# EAGLE design GauntletV2 (EAGLE 9.5.2)
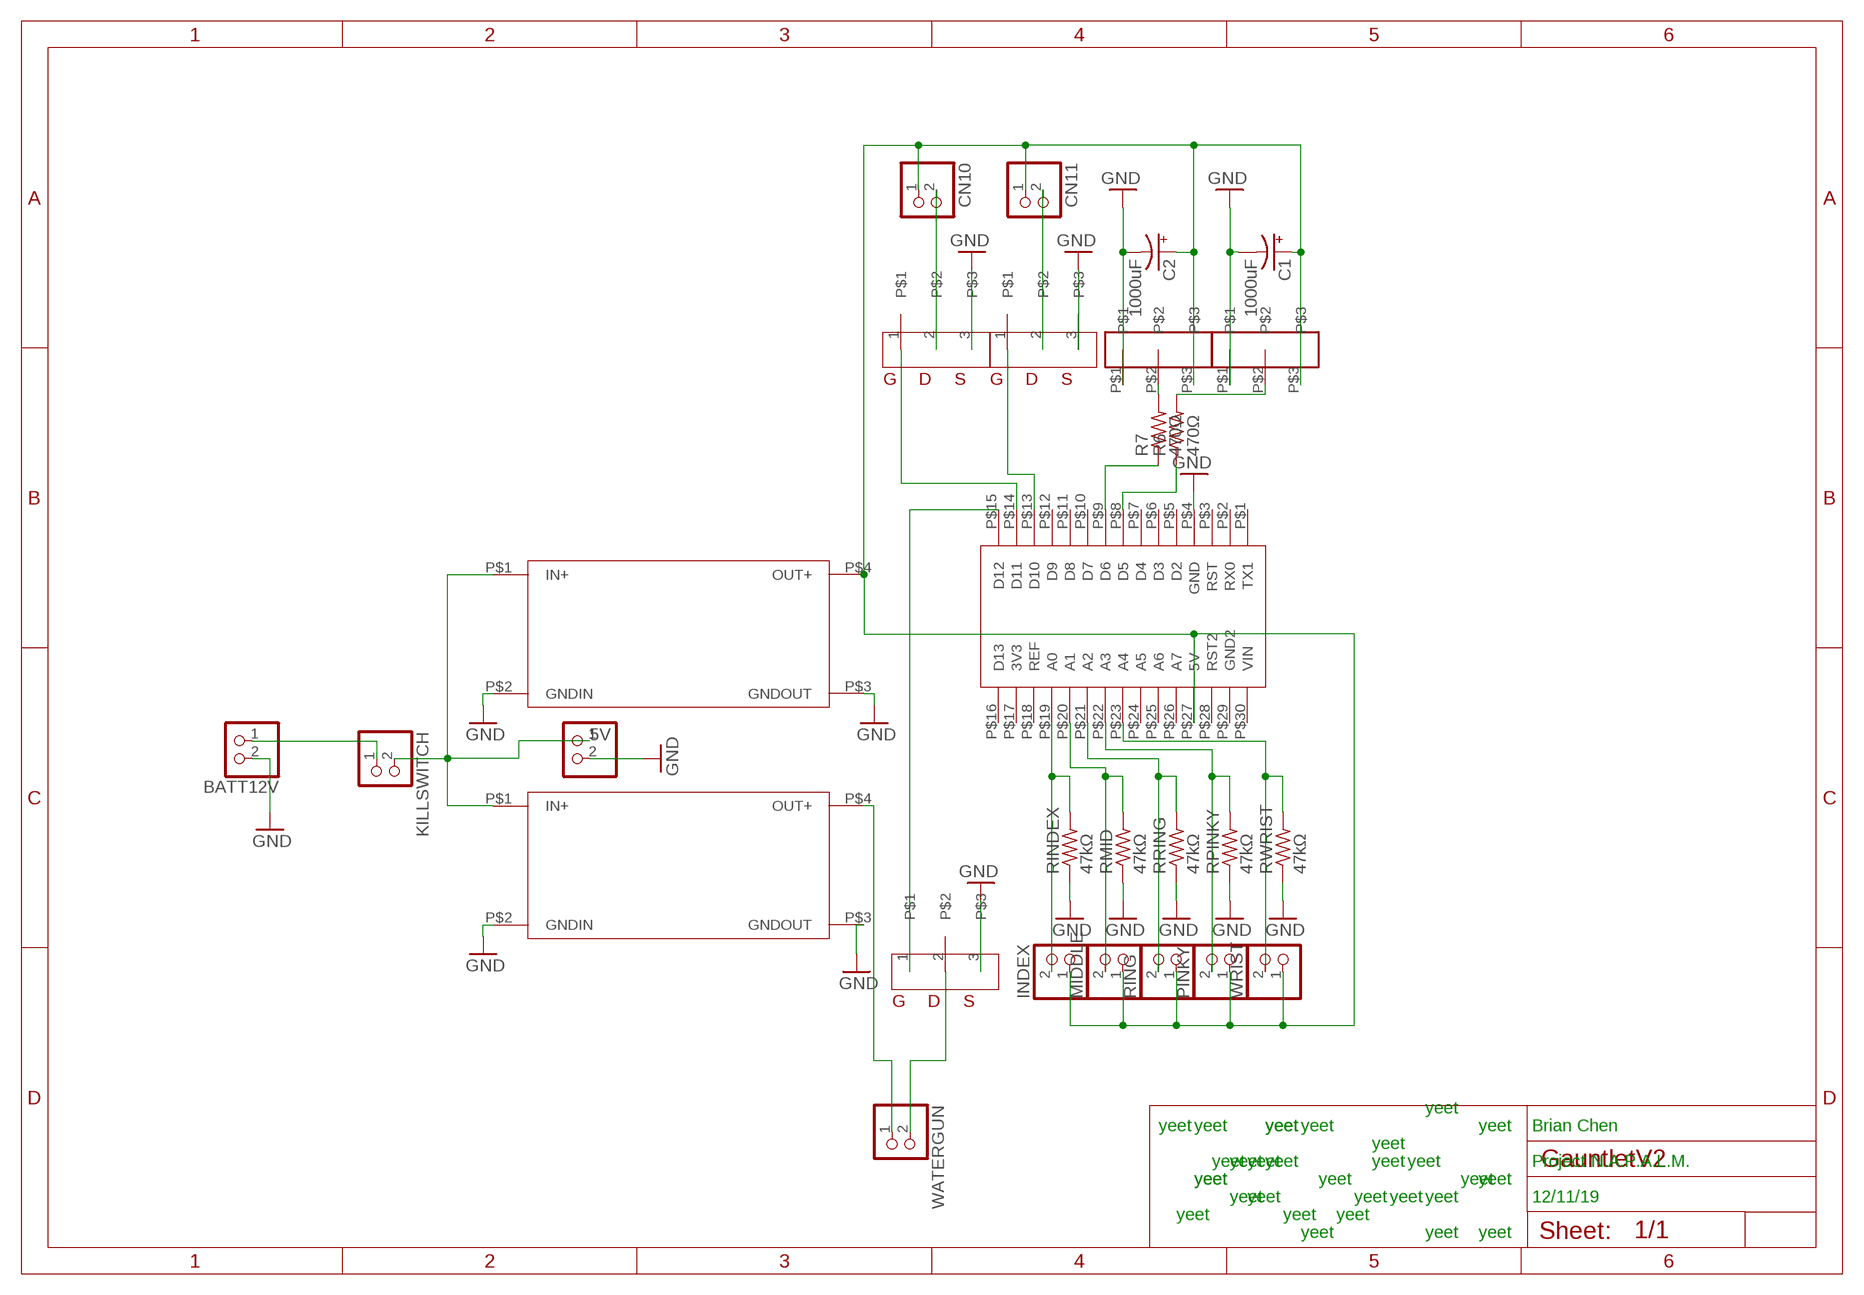
[diagram p0: schematic, sheet 1]

## Parts
5VBUCK  LM2596BUCK  [LM2596BUCK]
6VBUCK  LM2596BUCK  [LM2596BUCK]
BATT12V  JST_2PIN-THM-RA  [JST-PH-2-THM-RA]
C1  1000uF  CPOL-USE5-10.5  [E5-10,5]
C2  1000uF  CPOL-USE5-10.5  [E5-10,5]
CN10  JST_2PIN-THM-RA  [JST-PH-2-THM-RA]
CN11  JST_2PIN-THM-RA  [JST-PH-2-THM-RA]
GUNMOSFET  TO254P1052X465X1989-3  [TO254P1052X465X1989-3]
INDEX  JST_2PIN-THM-RA  [JST-PH-2-THM-RA]
KILLSWITCH  JST_2PIN-THM-RA  [JST-PH-2-THM-RA]
MIDDLE  JST_2PIN-THM-RA  [JST-PH-2-THM-RA]
NANO  NANOV3  [NANOV3]
PINKY  JST_2PIN-THM-RA  [JST-PH-2-THM-RA]
R6  470Ω  R-US_0207/9  [0207/9]
R7  470Ω  R-US_0207/9  [0207/9]
RINDEX  47kΩ  R-US_0207/9  [0207/9]
RING  JST_2PIN-THM-RA  [JST-PH-2-THM-RA]
RMID  47kΩ  R-US_0207/9  [0207/9]
RPINKY  47kΩ  R-US_0207/9  [0207/9]
RRING  47kΩ  R-US_0207/9  [0207/9]
RWRIST  47kΩ  R-US_0207/9  [0207/9]
U$4  TO254P1052X465X1989-3  [TO254P1052X465X1989-3]
U$5  TO254P1052X465X1989-3  [TO254P1052X465X1989-3]
U$7  3WIRECONNECTOR  [3WIRECONNECTOR]
U$8  3WIRECONNECTOR  [3WIRECONNECTOR]
VOLTMETER  JST_2PIN-THM-RA  [JST-PH-2-THM-RA]
WATERGUN  JST_2PIN-THM-RA  [JST-PH-2-THM-RA]
WRIST  JST_2PIN-THM-RA  [JST-PH-2-THM-RA]

## Nets
5V: 5VBUCK.P$1(IN+) 6VBUCK.P$1(IN+) KILLSWITCH.2 VOLTMETER.1
GND: 5VBUCK.P$2(GNDIN) 5VBUCK.P$3(GNDOUT) 6VBUCK.P$2(GNDIN) 6VBUCK.P$3(GNDOUT) BATT12V.2 C1.- C2.- GUNMOSFET.3 NANO.P$4(GND) RINDEX.1 RMID.1 RPINKY.1 RRING.1 RWRIST.1 U$4.3 U$5.3 U$7.P$1 U$8.P$1 VOLTMETER.2
N$1: BATT12V.1 KILLSWITCH.1
N$2: 5VBUCK.P$4(OUT+) C1.+ C2.+ CN10.1 CN11.1 INDEX.1 MIDDLE.1 NANO.P$27(5V) PINKY.1 RING.1 U$7.P$3 U$8.P$3 WRIST.1
N$3: R7.2 U$7.P$2
N$4: GUNMOSFET.2 WATERGUN.2
N$5: 6VBUCK.P$4(OUT+) WATERGUN.1
N$6: GUNMOSFET.1 NANO.P$15(D12)
N$7: INDEX.2 NANO.P$19(A0) RINDEX.2
N$8: NANO.P$23(A4) RWRIST.2 WRIST.2
N$9: NANO.P$21(A2) RING.2 RRING.2
N$10: MIDDLE.2 NANO.P$20(A1) RMID.2
N$11: NANO.P$22(A3) PINKY.2 RPINKY.2
N$12: NANO.P$14(D11) U$5.1
N$13: NANO.P$13(D10) U$4.1
N$14: CN10.2 U$5.2
N$15: CN11.2 U$4.2
N$16: NANO.P$9(D6) R7.1
N$17: R6.2 U$8.P$2
N$18: NANO.P$8(D5) R6.1
Unconnected: NANO.P$1(TX1) NANO.P$2(RX0) NANO.P$3(RST) NANO.P$5(D2) NANO.P$6(D3) NANO.P$7(D4) NANO.P$10(D7) NANO.P$11(D8) NANO.P$12(D9) NANO.P$16(D13) NANO.P$17(3V3) NANO.P$18(REF) NANO.P$24(A5) NANO.P$25(A6) NANO.P$26(A7) NANO.P$28(RST2) NANO.P$29(GND2) NANO.P$30(VIN)

## Notes on the sheet
- yeet
- yeet | yeet | yeet | yeet | yeet | yeet | Brian Chen
- yeet
- yeet | yeet | yeet | yeet | yeet | yeet | Project N.A.P.A.L.M.
- yeet | yeet | yeet | yeet | yeet
- yeet | yeet | yeet | yeet | yeet | 12/11/19
- yeet | yeet | yeet
- yeet | yeet | yeet

## Library data of the parts
5VBUCK 6VBUCK = GauntletV2:LM2596BUCK
BATT12V CN10 CN11 INDEX KILLSWITCH MIDDLE PINKY RING VOLTMETER WATERGUN WRIST = adafruit:JST_2PIN: JST 2-Pin Connectors of various flavors SMT-RA (S2B-PH-SM4) 4UConnector #17311 SMT (B2B-PH-SM4) THM-RA (S2B-PH) THM (B2B-PH)
C1 C2 = adafruit:CPOL-US: POLARIZED CAPACITOR, American symbol
GUNMOSFET U$4 U$5 = TO254P1052X465X1989-3:TO254P1052X465X1989-3
NANO = GauntletV2:NANOV3
R6 R7 RINDEX RMID RPINKY RRING RWRIST = adafruit:R-US_: RESISTOR, American symbol
U$7 U$8 = GauntletV2:3WIRECONNECTOR

## Board
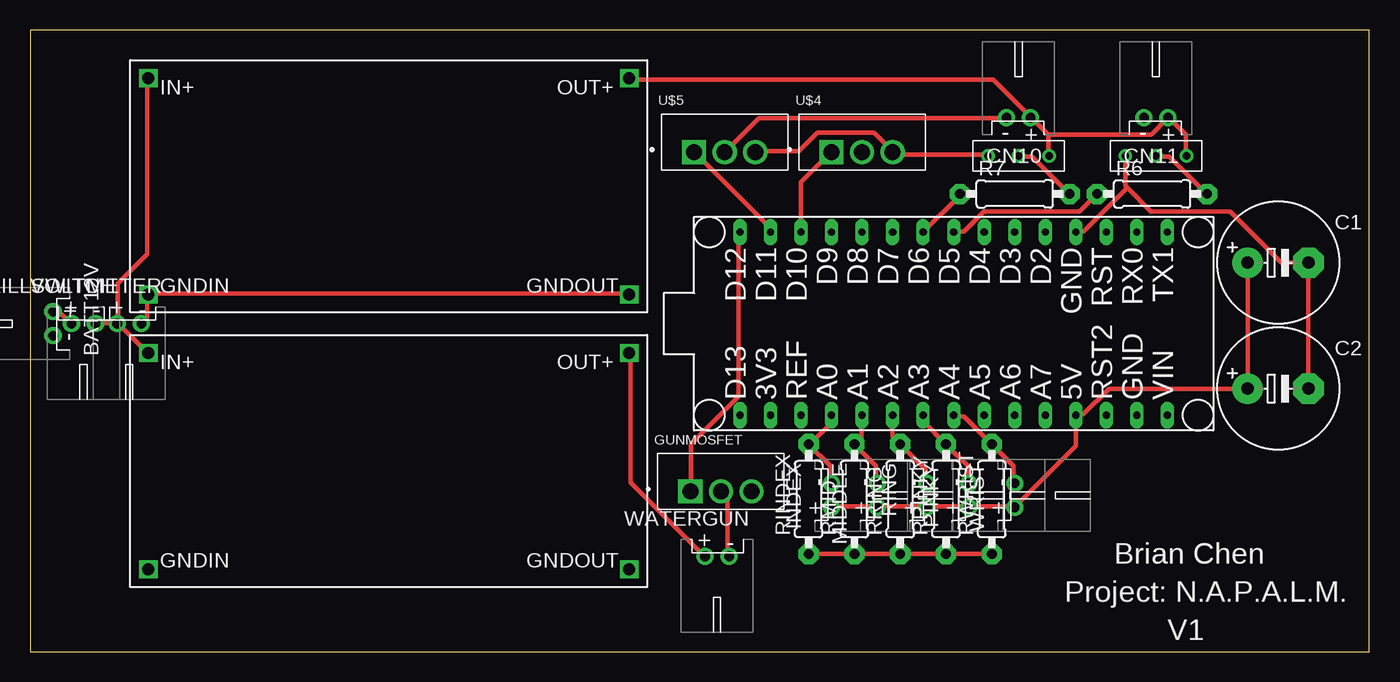
[diagram p1: board, top side]
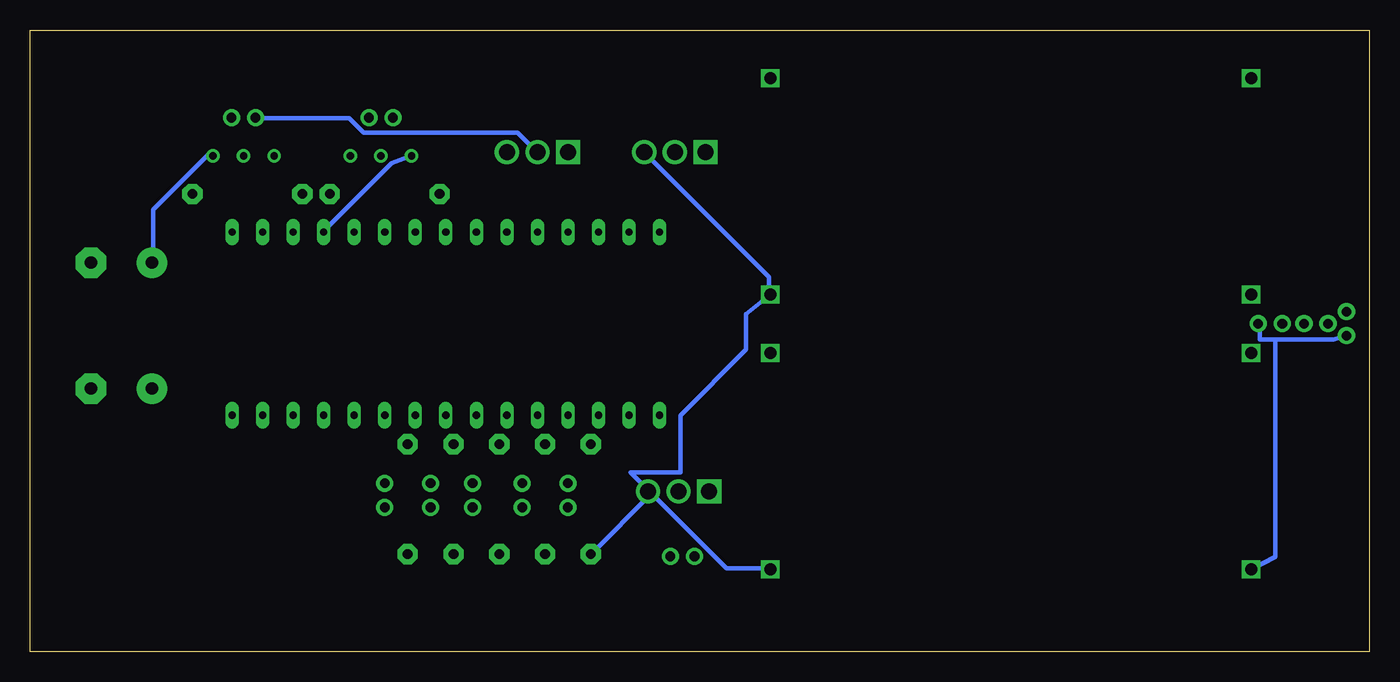
[diagram p2: board, bottom side, seen from below]

Size 111.42 x 51.74 mm. Coordinates in mm from the lower left corner, seen from the top.
Outline: 0,0 111.42,0 111.42,51.74 0,51.74 0,0
Copper layers (1*16): Top 0.035mm / dielectric 1.5mm / Bottom 0.035mm
Design rules "default": minimum track width 6mil, minimum drill 0.35mm, track to track 6mil, track to pad 6mil, pad to pad 6mil, via to via 6mil, smd to smd 6mil, copper to edge 40mil, drill to drill 6mil, minimum pad ring 10mil, minimum via ring 8mil, stop-mask expansion 4mil, vias tented up to drill 0mil, thermal gap 10mil

### Footprints (pad centres in the part's own frame; a part is rotated, then mirrored left to right if it is on the bottom)
LM2596BUCK = drill 1 square: P$1 -20,9; P$2 -20,-9; P$3 20,-9; P$4 20,9
JST-PH-2-THM-RA = drill 0.8 pad 1.422: 1 1,0; 2 -1,0
E5-10,5 = drill 1.016 pad 2.54: + -2.54,0 | drill 1.016 pad 2.54 octagon: - 2.54,0
TO254P1052X465X1989-3 = drill 1.34 pad 2.01 square: 1 0,0 | drill 1.34 pad 2.01: 2 2.54,0; 3 5.08,0
NANOV3 = drill 0.6 long: P$1 -7.62,17.78; P$2 -7.62,15.24; P$3 -7.62,12.7; P$4 -7.62,10.16; P$5 -7.62,7.62; P$6 -7.62,5.08; P$7 -7.62,2.54; P$8 -7.62,0; P$9 -7.62,-2.54; P$10 -7.62,-5.08; P$11 -7.62,-7.62; P$12 -7.62,-10.16; P$13 -7.62,-12.7; P$14 -7.62,-15.24; P$15 -7.62,-17.78; P$16 7.62,-17.78; P$17 7.62,-15.24; P$18 7.62,-12.7; P$19 7.62,-10.16; P$20 7.62,-7.62; P$21 7.62,-5.08; P$22 7.62,-2.54; P$23 7.62,0; P$24 7.62,2.54; P$25 7.62,5.08; P$26 7.62,7.62; P$27 7.62,10.16; P$28 7.62,12.7; P$29 7.62,15.24; P$30 7.62,17.78
0207/9 = drill 0.813 pad 1.676 octagon: 1 -4.572,0; 2 4.572,0
3WIRECONNECTOR = drill 0.6: P$1 -2.54,0; P$2 0,0; P$3 2.54,0

### Placement (x,y rotation side)
5VBUCK  29.84,38.73 0 top
6VBUCK  29.84,15.88 0 top
BATT12V  1.91,27.3 90 top
C1  103.82,32.38 0 top
C2  103.82,21.91 0 top
CN10  82.23,44.45 0 top
CN11  93.66,44.45 0 top
GUNMOSFET  54.93,13.34 0 top
INDEX  66.67,13.02 270 top
KILLSWITCH  4.45,27.3 180 top
MIDDLE  70.48,13.02 270 top
NANO  76.83,27.3 270 top
PINKY  78.1,13.02 270 top
R6  93.34,38.1 0 top
R7  81.91,38.1 0 top
RINDEX  64.77,12.7 90 top
RING  74.61,13.02 270 top
RMID  68.58,12.7 90 top
RPINKY  76.2,12.7 90 top
RRING  72.39,12.7 90 top
RWRIST  80.01,12.7 90 top
U$4  66.67,41.59 0 top
U$5  55.25,41.59 0 top
U$7  82.23,41.28 0 top
U$8  93.66,41.28 0 top
VOLTMETER  8.26,27.3 180 top
WATERGUN  57.15,7.94 180 top
WRIST  81.91,13.02 270 top

### Tracks (layer width: path | path; a pad name or v marks a point on that pad's centre or on a via)
5V
  Top 0.152: 9.73,47.62 5VBUCK.P$1 | 7.29,27.36 VOLTMETER.1 7.14,27.36
  Top 0.381: 6VBUCK.P$1 9.73,24.92 7.29,27.36 7.29,30.64 9.73,33.08 9.73,47.62 | 7.14,27.36 5.46,27.36 KILLSWITCH.2
GND
  Top 0.152: 68.55,8.15 RMID.1 | 72.36,8.15 RRING.1 | 76.17,8.15 RPINKY.1 76.33,8.15 | 79.98,8.15 RWRIST.1 | 9.73,29.64 5VBUCK.P$2 9.88,29.79 | 9.27,27.36 VOLTMETER.2 | 86.99,34.98 NANO.P$4 | 91.11,41.22 U$8.P$1 | 79.68,41.38 U$7.P$1 | 106.35,32.38 C1.- | 49.81,29.79 5VBUCK.P$3
  Top 0.381: 68.55,8.15 64.9,8.15 RINDEX.1 | 72.36,8.15 68.71,8.15 RMID.1 | 76.17,8.15 72.52,8.15 RRING.1 | 76.33,8.15 79.98,8.15 | 9.73,29.64 9.73,27.81 9.27,27.36 | C2.- 106.35,22.02 106.35,32.38 104.09,32.38 99.83,36.64 93.26,36.64 91.27,38.63 | 86.99,34.98 87.62,34.98 91.27,38.63 | 91.11,41.22 91.11,38.79 91.27,38.63 | 79.68,41.38 71.91,41.38 71.75,41.53 U$4.3 71.75,41.68 70.22,43.22 65.51,43.22 63.97,41.68 60.33,41.68 U$5.3 | 49.81,29.79 9.88,29.79
  Bottom 0.152: 59.72,13.18 59.87,13.34 GUNMOSFET.3 | 60.33,41.53 U$5.3
  Bottom 0.381: 59.87,13.34 61.46,14.92 57.33,14.92 57.33,19.69 51.87,25.15 51.87,28.12 5VBUCK.P$3 49.96,29.79 49.96,31.17 60.33,41.53 | 59.72,13.18 53.47,6.93 49.96,6.93 6VBUCK.P$3 | RINDEX.1 59.72,13.18 | 59.72,13.18 GUNMOSFET.3 | 7.82,25.97 7.82,7.9 6VBUCK.P$2 | VOLTMETER.2 9.12,27.2 9.12,25.97 7.82,25.97 | 7.82,25.97 2.96,25.97 BATT12V.2 | NANO.P$4 86.99,35.01 81.33,40.68 U$7.P$1
N$1
  Top 0.152: 3.33,27.36 KILLSWITCH.1
  Top 0.381: 3.33,27.36 2.41,28.27 1.96,28.27 BATT12V.1
N$2
  Top 0.152: 70.38,12.12 MIDDLE.1 | 74.65,12.12 RING.1 | 78,12.12 PINKY.1 78.16,12.12 | 81.97,12.12 WRIST.1 | 96.14,41.38 U$8.P$3 | 94.77,44.42 CN11.1 | 83.18,44.58 CN10.1 83.34,44.42 | 84.71,41.38 U$7.P$3
  Top 0.381: 70.38,12.12 66.73,12.12 INDEX.1 | 78,12.12 74.65,12.12 | 81.97,12.12 86.99,17.14 NANO.P$27 86.99,19.74 87.59,19.74 89.73,21.87 101.17,21.87 C2.+ 101.32,22.02 101.32,32.38 C1.+ | 78.16,12.12 81.81,12.12 WRIST.1 | MIDDLE.1 70.54,12.12 74.5,12.12 RING.1 | 96.14,41.38 96.14,43.05 94.77,44.42 | 83.18,44.58 80.14,47.62 49.96,47.62 5VBUCK.P$4 | 84.71,43.05 84.71,41.38 | 83.34,44.42 84.71,43.05 | CN11.1 93.27,43.05 84.71,43.05
  Bottom 0.381: C1.+ 101.17,32.38 101.17,36.82 96.44,41.55 U$8.P$3
N$3
  Top 0.152: 86.38,38.18 R7.2
  Top 0.381: 86.38,38.18 83.34,41.22 82.27,41.22 U$7.P$2
N$4
  Top 0.381: WATERGUN.2 58.04,8 58.04,12.88 57.58,13.34 GUNMOSFET.2
N$5
  Top 0.381: 6VBUCK.P$4 49.96,24.77 49.96,14.1 56.06,8 WATERGUN.1
N$6
  Top 0.152: 54.99,13.34 GUNMOSFET.1
  Top 0.381: 54.99,13.34 54.99,17.3 58.95,21.26 58.95,34.82 NANO.P$15
N$7
  Top 0.381: NANO.P$19 66.57,19.58 66.57,18.97 64.9,17.3 RINDEX.2 66.57,15.47 66.57,14.1 INDEX.2
N$8
  Top 0.381: NANO.P$23 76.94,19.58 77.7,19.58 RWRIST.2 81.81,15.47 81.81,14.1 WRIST.2
N$9
  Top 0.381: NANO.P$21 71.75,17.91 RRING.2 74.5,15.16 74.5,14.1 RING.2
N$10
  Top 0.152: 68.71,17.3 RMID.2
  Top 0.381: 68.71,17.3 69.16,17.76 69.16,19.58 NANO.P$20 | RMID.2 70.38,15.47 70.38,14.1 MIDDLE.2
N$11
  Top 0.381: NANO.P$22 74.35,19.58 74.35,19.13 RPINKY.2 78,15.47 78,14.1 PINKY.2
N$12
  Top 0.381: NANO.P$14 61.54,34.98 61.54,35.28 55.3,41.53 U$5.1
N$13
  Top 0.152: 66.57,41.53 U$4.1
  Top 0.381: NANO.P$13 64.13,39.09 66.57,41.53
N$14
  Top 0.152: 81.2,44.42 CN10.2
  Top 0.381: 81.2,44.42 60.63,44.42 57.89,41.68 U$5.2
N$15
  Bottom 0.152: 92.63,44.42 CN11.2 | 69.32,41.68 U$4.2
  Bottom 0.381: 92.63,44.42 84.87,44.42 83.67,43.22 70.85,43.22 69.32,41.68
N$16
  Top 0.381: NANO.P$9 77.39,38.02 R7.1
N$17
  Top 0.152: 93.7,41.22 U$8.P$2 | 97.81,38.18 R6.2
  Top 0.381: 93.7,41.22 94.77,41.22 97.81,38.18
N$18
  Top 0.381: NANO.P$8 76.94,34.98 77.7,34.98 79.36,36.64 87.29,36.64 88.67,38.02 R6.1

### Text on the board
tNames: Brian Chen | Project: N.A.P.A.L.M. | V1